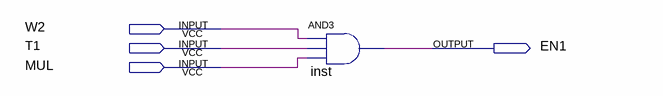
[diagram p0: schematic sheet]
// Quartus schematic EN1.bdf as structural Verilog: 1 symbols, 4 pins
module EN1 (
  input  W2,
  input  T1,
  input  MUL,
  output EN1
);

  and inst (EN1, W2, T1, MUL);
endmodule
